# Altium schematic sheet summary.SchDoc
size A3; Hw_rev: R1; Address3: Firenze; Address4: ITALY; Revision: 0; SheetNumber: 1; SheetTotal: 6
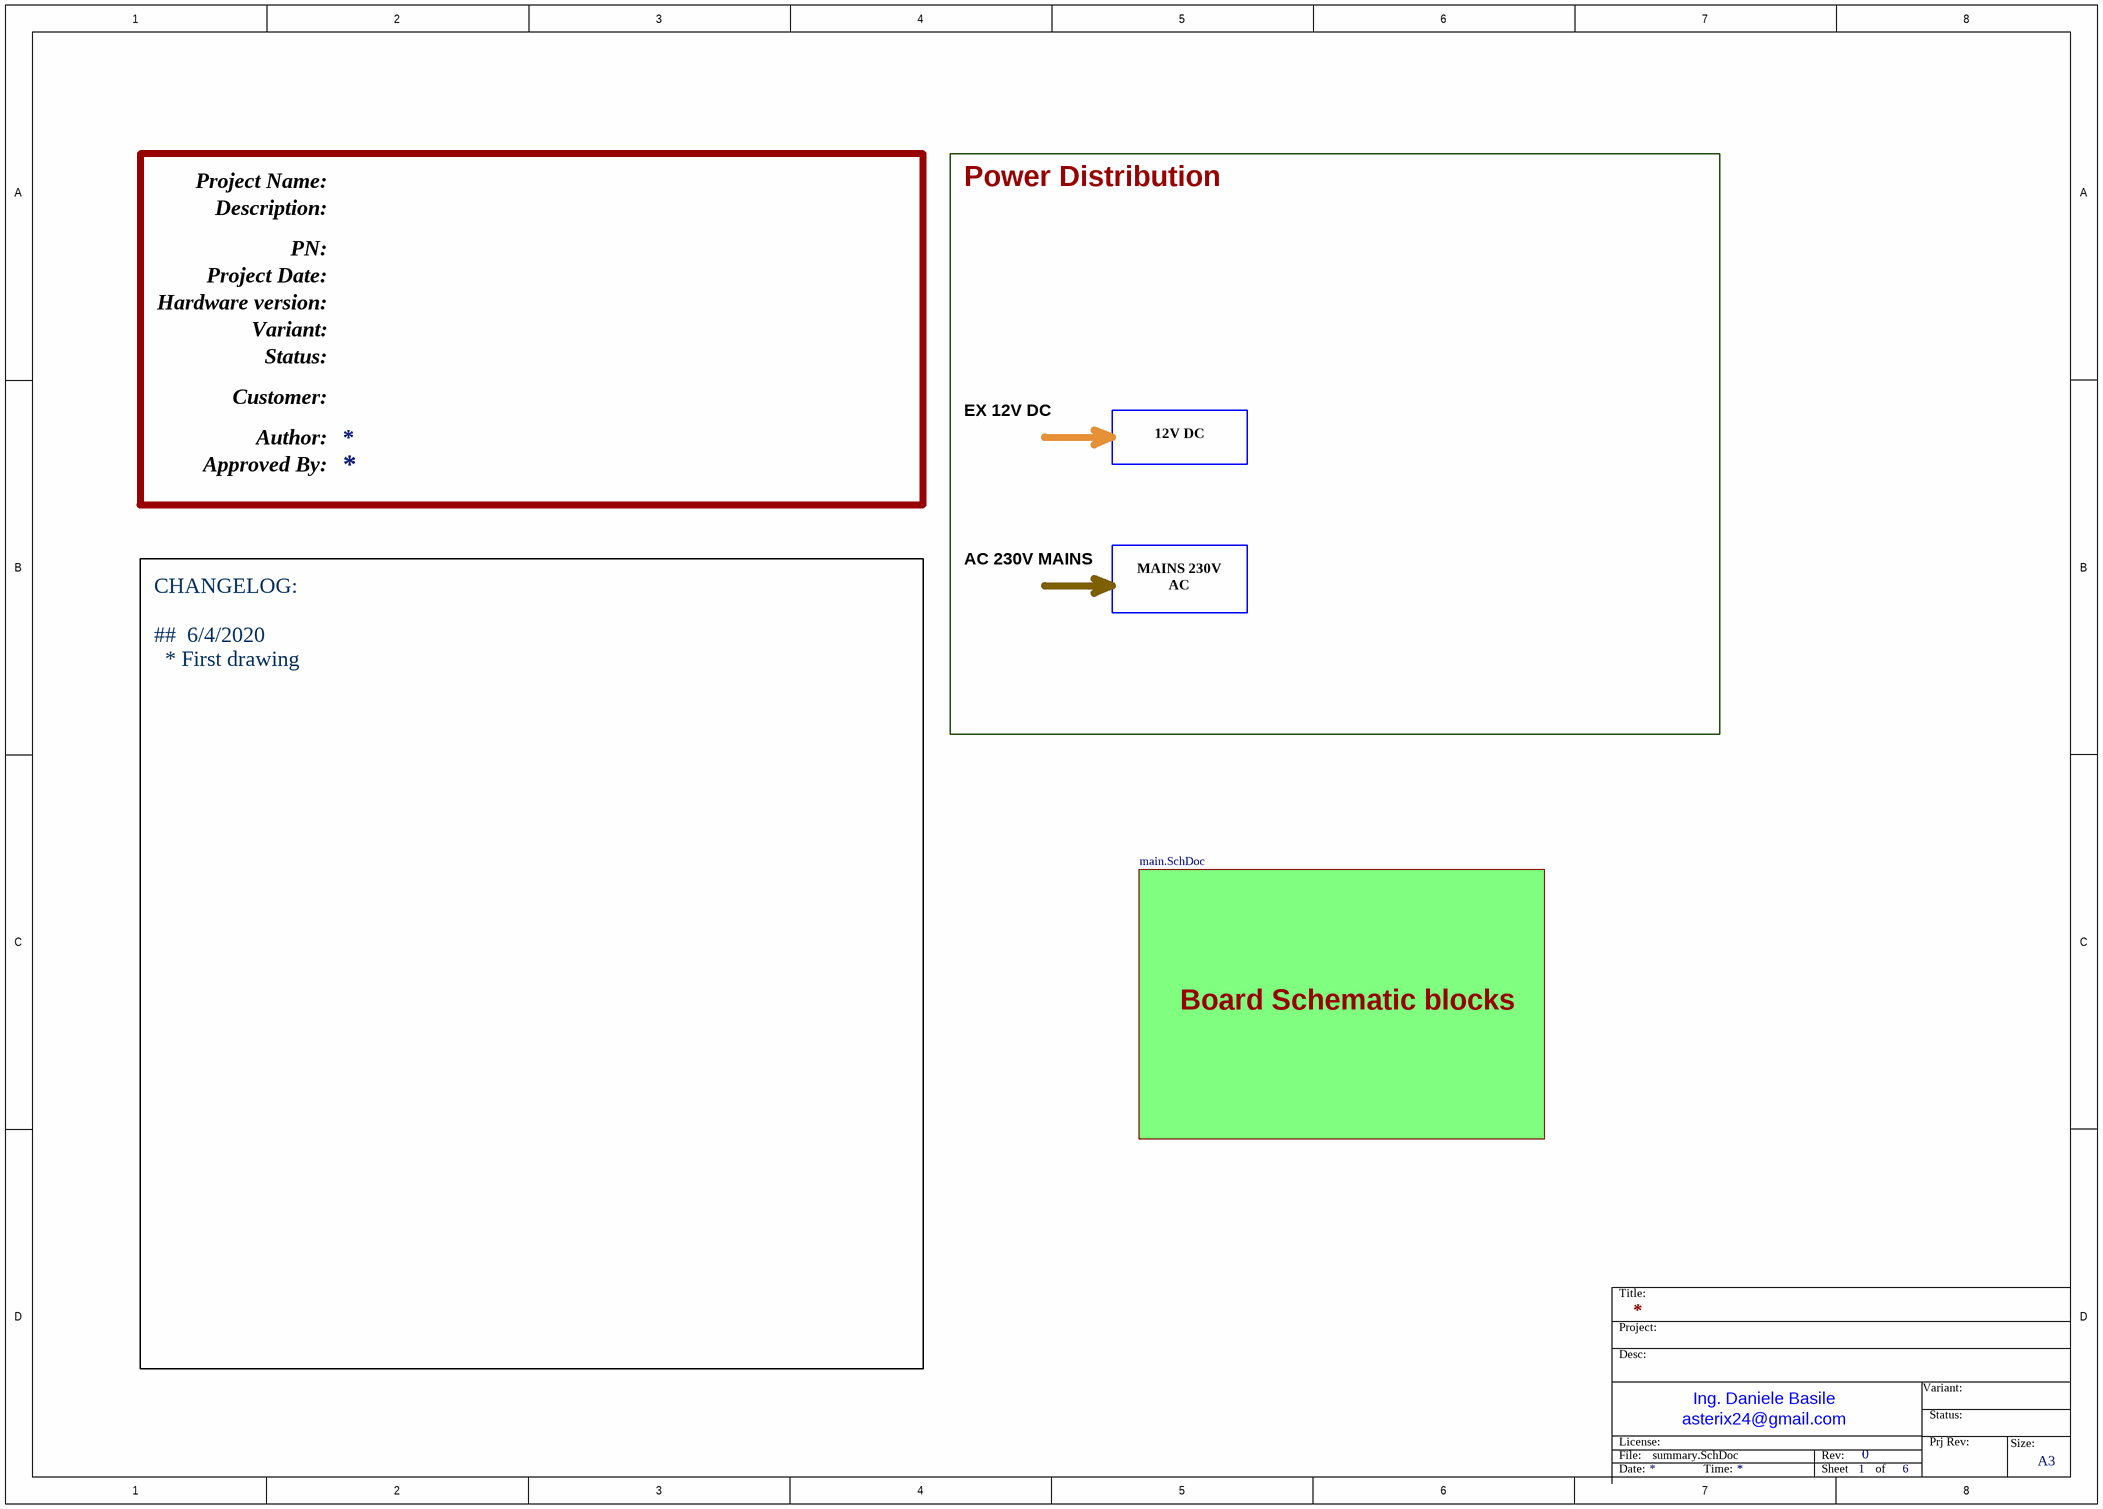
[diagram p0: summary.SchDoc]

## Sub-sheets
? = main.SchDoc: no entries

## Notes on the sheet
- Project Name:
- Description:
- PN:
- Power Distribution
- Hardware version:
- Project Date:
- Variant:
- Status:
- Author:
- Customer:
- EX 12V DC
- Approved By:
- 12V DC
- AC 230V MAINS
- MAINS 230V AC
- Board Schematic blocks
- CHANGELOG:
  ##  6/4/2020
  * First drawing
- Title:
- Project:
- Desc:
- File:
- License:
- asterix24@gmail.com
- Ing. Daniele Basile
- Rev:
- Prj Rev:
- Size:
- Date:
- Time:
- Sheet
- of
- A3